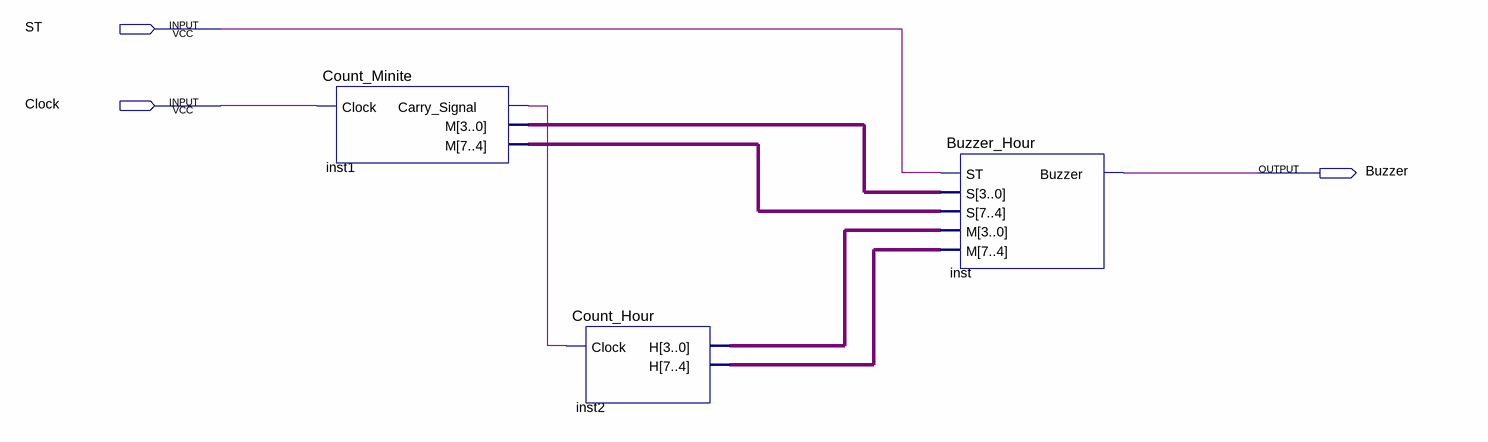
[diagram p0: schematic sheet]
// Quartus schematic Buzzer_Hour_Simulation.bdf as structural Verilog: 3 symbols, 3 pins
module Buzzer_Hour_Simulation (
  input  ST,
  input  Clock,
  output Buzzer
);

  wire inst1_carry_signal;
  wire [3:0] inst1_m, inst1_m_2, inst2_h, inst2_h_2;

  Count_Minite inst1 (.Clock(Clock), .Carry_Signal(inst1_carry_signal), .M({inst1_m_2, inst1_m}));
  Count_Hour inst2 (.Clock(inst1_carry_signal), .H({inst2_h, inst2_h_2}));
  Buzzer_Hour inst (.ST(ST), .S({inst1_m_2, inst1_m}), .M({inst2_h, inst2_h_2}), .Buzzer(Buzzer));
endmodule
